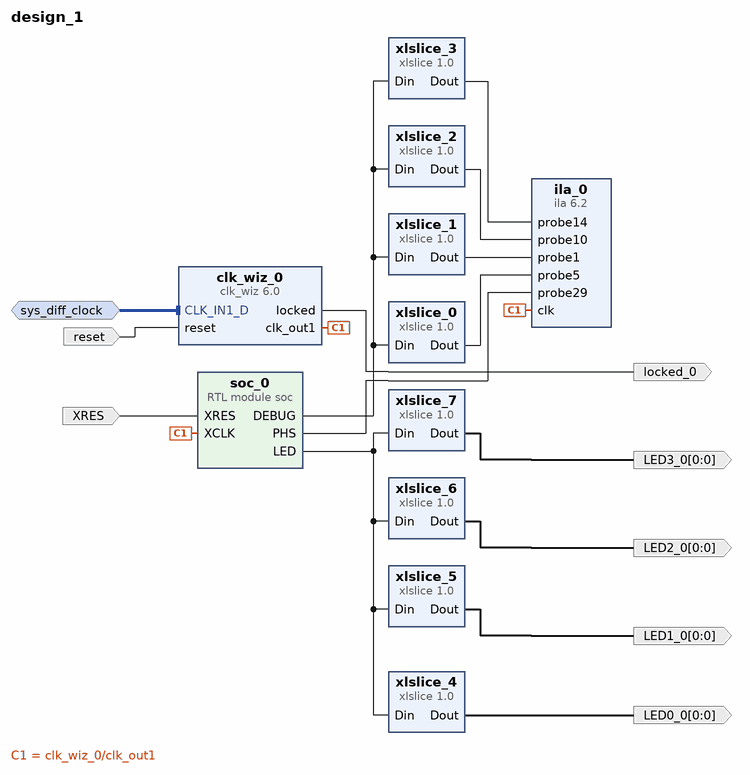
[diagram p0: block diagram of the top level]
# Vivado block design design_1, xc7s100fgga676-2, Vivado 2020.2
create_bd_design design_1

create_bd_intf_port -mode Slave -vlnv xilinx.com:interface:diff_clock_rtl:1.0 sys_diff_clock
set_property -dict {CONFIG.FREQ_HZ 200000000} [get_bd_intf_ports sys_diff_clock]
create_bd_port -dir O -from 0 -to 0 LED3_0
create_bd_port -dir O -from 0 -to 0 LED2_0
create_bd_port -dir O -from 0 -to 0 LED1_0
create_bd_port -dir O -from 0 -to 0 LED0_0
create_bd_port -dir I -type rst reset
set_property -dict {CONFIG.POLARITY ACTIVE_HIGH} [get_bd_ports reset]
create_bd_port -dir O locked_0
create_bd_port -dir I XRES

create_bd_cell -type ip -vlnv xilinx.com:ip:clk_wiz:6.0 clk_wiz_0
set_property -dict {CONFIG.CLK_IN1_BOARD_INTERFACE sys_diff_clock CONFIG.USE_BOARD_FLOW true} [get_bd_cells clk_wiz_0]
create_bd_cell -type ip -vlnv xilinx.com:ip:ila:6.2 ila_0
create_bd_cell -type ip -vlnv xilinx.com:ip:xlslice:1.0 xlslice_0
set_property -dict {CONFIG.DIN_FROM 31 CONFIG.DIN_TO 0 CONFIG.DIN_WIDTH 128 CONFIG.DOUT_WIDTH 32} [get_bd_cells xlslice_0]
create_bd_cell -type ip -vlnv xilinx.com:ip:xlslice:1.0 xlslice_1
set_property -dict {CONFIG.DIN_FROM 63 CONFIG.DIN_TO 32 CONFIG.DIN_WIDTH 128 CONFIG.DOUT_WIDTH 32} [get_bd_cells xlslice_1]
create_bd_cell -type ip -vlnv xilinx.com:ip:xlslice:1.0 xlslice_2
set_property -dict {CONFIG.DIN_FROM 95 CONFIG.DIN_TO 64 CONFIG.DIN_WIDTH 128 CONFIG.DOUT_WIDTH 32} [get_bd_cells xlslice_2]
create_bd_cell -type ip -vlnv xilinx.com:ip:xlslice:1.0 xlslice_3
set_property -dict {CONFIG.DIN_FROM 127 CONFIG.DIN_TO 96 CONFIG.DIN_WIDTH 128 CONFIG.DOUT_WIDTH 32} [get_bd_cells xlslice_3]
create_bd_cell -type ip -vlnv xilinx.com:ip:xlslice:1.0 xlslice_4
set_property -dict {CONFIG.DIN_FROM 0 CONFIG.DIN_TO 0 CONFIG.DIN_WIDTH 4 CONFIG.DOUT_WIDTH 1} [get_bd_cells xlslice_4]
create_bd_cell -type ip -vlnv xilinx.com:ip:xlslice:1.0 xlslice_5
set_property -dict {CONFIG.DIN_FROM 1 CONFIG.DIN_TO 1 CONFIG.DIN_WIDTH 4 CONFIG.DOUT_WIDTH 1} [get_bd_cells xlslice_5]
create_bd_cell -type ip -vlnv xilinx.com:ip:xlslice:1.0 xlslice_6
set_property -dict {CONFIG.DIN_FROM 2 CONFIG.DIN_TO 2 CONFIG.DIN_WIDTH 4 CONFIG.DOUT_WIDTH 1} [get_bd_cells xlslice_6]
create_bd_cell -type ip -vlnv xilinx.com:ip:xlslice:1.0 xlslice_7
set_property -dict {CONFIG.DIN_FROM 3 CONFIG.DIN_TO 3 CONFIG.DIN_WIDTH 4 CONFIG.DOUT_WIDTH 1} [get_bd_cells xlslice_7]
create_bd_cell -type module -reference soc soc_0

# ---- connections ----

connect_bd_intf_net [get_bd_intf_ports sys_diff_clock] [get_bd_intf_pins clk_wiz_0/CLK_IN1_D]
connect_bd_net [get_bd_pins clk_wiz_0/clk_out1] [get_bd_pins ila_0/clk] [get_bd_pins soc_0/XCLK]
connect_bd_net [get_bd_pins xlslice_0/Dout] [get_bd_pins ila_0/probe5]
connect_bd_net [get_bd_pins xlslice_1/Dout] [get_bd_pins ila_0/probe1]
connect_bd_net [get_bd_pins xlslice_2/Dout] [get_bd_pins ila_0/probe10]
connect_bd_net [get_bd_pins xlslice_3/Dout] [get_bd_pins ila_0/probe14]
connect_bd_net [get_bd_pins soc_0/DEBUG] \
  [get_bd_pins xlslice_3/Din] [get_bd_pins xlslice_2/Din] [get_bd_pins xlslice_1/Din] [get_bd_pins xlslice_0/Din]
connect_bd_net [get_bd_pins soc_0/LED] [get_bd_pins xlslice_4/Din] [get_bd_pins xlslice_6/Din] [get_bd_pins xlslice_5/Din] [get_bd_pins xlslice_7/Din]
connect_bd_net [get_bd_pins xlslice_7/Dout] [get_bd_ports LED3_0]
connect_bd_net [get_bd_pins xlslice_6/Dout] [get_bd_ports LED2_0]
connect_bd_net [get_bd_pins xlslice_5/Dout] [get_bd_ports LED1_0]
connect_bd_net [get_bd_pins xlslice_4/Dout] [get_bd_ports LED0_0]
connect_bd_net [get_bd_pins clk_wiz_0/locked] [get_bd_ports locked_0]
connect_bd_net [get_bd_ports reset] [get_bd_pins clk_wiz_0/reset]
connect_bd_net [get_bd_ports XRES] [get_bd_pins soc_0/XRES]
connect_bd_net [get_bd_pins soc_0/PHS] [get_bd_pins ila_0/probe29]

validate_bd_design
save_bd_design
